# EAGLE design motor_driver_shield (EAGLE 9.6.2)
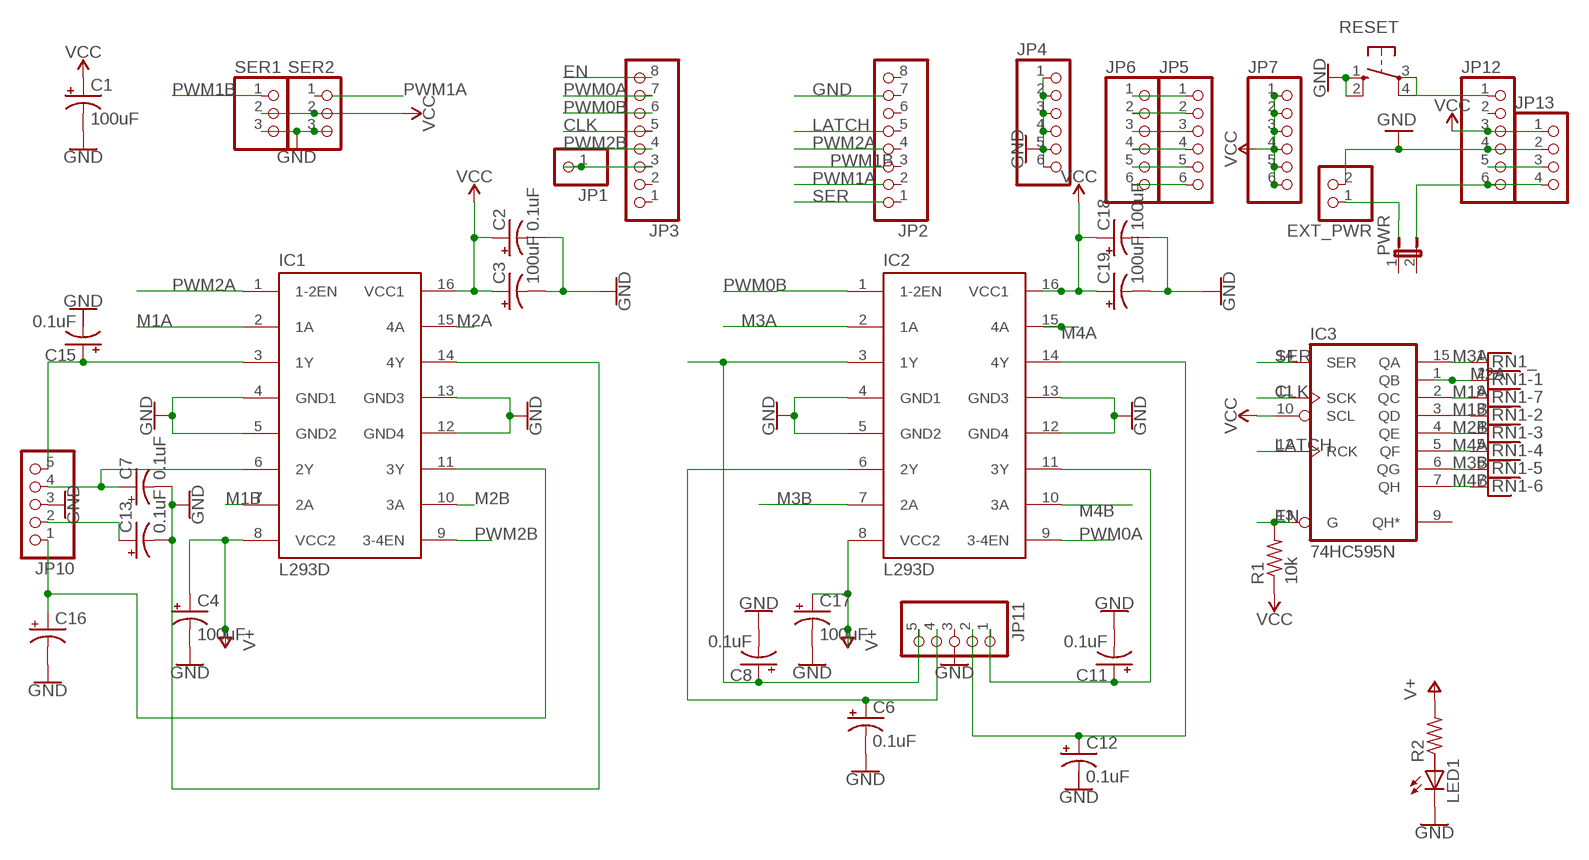
[diagram p0: schematic, sheet 1]

## Parts
C1  100uF  CPOL-USB45181A  [B45181A]
C2  0.1uF  CPOL-USB45181A  [B45181A]
C3  100uF  CPOL-USB45181A  [B45181A]
C4  100uF  CPOL-USB45181A  [B45181A]
C6  0.1uF  CPOL-USB45181A  [B45181A]
C7  0.1uF  CPOL-USB45181A  [B45181A]
C8  0.1uF  CPOL-USB45181A  [B45181A]
C11  0.1uF  CPOL-USB45181A  [B45181A]
C12  0.1uF  CPOL-USB45181A  [B45181A]
C13  0.1uF  CPOL-USB45181A  [B45181A]
C15  0.1uF  CPOL-USB45181A  [B45181A]
C16  CPOL-USB45181A  [B45181A]
C17  100uF  CPOL-USB45181A  [B45181A]
C18  100uF  CPOL-USB45181A  [B45181A]
C19  100uF  CPOL-USB45181A  [B45181A]
EXT_PWR  PINHD-1X2  [1X02]
IC1  L293D  [DIL16]
IC2  L293D  [DIL16]
IC3  74HC595N  [DIL16]
JP1  PINHD-1X1  [1X01]
JP2  PINHD-1X8-3.5MM  [1X08-3.5MM]
JP3  PINHD-1X8-3.5MM  [1X08-3.5MM]
JP4  PINHD-1X6-3.5MM  [1X06-3.5MM]
JP5  PINHD-1X6-3.5MM  [1X06-3.5MM]
JP6  PINHD-1X6-3.5MM  [1X06-3.5MM]
JP7  PINHD-1X6-3.5MM  [1X06-3.5MM]
JP10  PINHD-1X5  [1X05]
JP11  PINHD-1X5  [1X05]
JP12  PINHD-1X6-3.5MM  [1X06-3.5MM]
JP13  PINHD-1X4  [1X04]
LED1  LED5MM  [LED5MM]
PWR  JP1E  [JP1]
R1  10k  R-US_0204/2V  [0204V]
R2  R-US_0204/2V  [0204V]
RESET  40-XX  [B3F-40XX]
RN1  RNX7  [RN-8]
SER1  PINHD-1X3  [1X03]
SER2  PINHD-1X3  [1X03]

## Nets
CLK: IC3.11(SCK) JP3.5
EN: IC3.13(G) JP3.8 R1.2
GND: C1.- C2.- C3.- C4.- C6.- C7.- C8.- C11.- C13.- C16.- C17.- C18.- C19.- EXT_PWR.2 IC1.4(GND1) IC1.5(GND2) IC1.12(GND4) IC1.13(GND3) IC1.14(4Y) IC2.4(GND1) IC2.5(GND2) IC2.12(GND4) IC2.13(GND3) JP4.1 JP4.2 JP4.3 JP4.4 JP4.5 JP4.6 JP10.3 JP12.4 JP13.2 LED1.K(C) RESET.1(S) RESET.2(S1) SER1.3 SER2.3
LATCH: IC3.12(RCK)
M1A: IC1.2(1A) IC3.2(QC) RN1.8
M1B: IC1.7(2A) IC3.3(QD) RN1.3
M2A: IC1.15(4A) IC3.1(QB) RN1.2
M2B: IC1.10(3A) IC3.4(QE) RN1.4
M3A: IC2.2(1A) IC3.15(QA) RN1.1
M3B: IC2.7(2A) IC3.6(QG) RN1.6
M4A: IC2.15(4A) IC3.5(QF) RN1.5
M4B: IC2.10(3A) IC3.7(QH) RN1.7
N$1: JP5.1 JP6.1
N$2: JP5.2 JP6.2
N$3: JP5.3 JP6.3
N$4: JP5.4 JP6.4
N$5: JP5.5 JP6.5
N$6: JP1.1 JP3.3
N$7: JP5.6 JP6.6
N$9: C11.+ IC2.11(3Y) JP11.1
N$10: C6.+ IC2.6(2Y) JP11.4
N$11: C8.+ IC2.3(1Y) JP11.5
N$12: JP12.1 RESET.3(P) RESET.4(P1)
N$13: JP12.5 JP13.3
N$14: JP12.6 JP13.4
N$15: EXT_PWR.1
N$17: C15.+ IC1.3(1Y) JP10.5
N$18: C16.+ IC1.11(3Y) JP10.1
N$19: C7.+ IC1.6(2Y) JP10.4
N$20: C13.+ JP10.2
N$21: C12.+ IC2.14(4Y) JP11.2
PWM0A: IC2.9(3-4EN) JP3.7
PWM0B: IC2.1(1-2EN) JP3.6
PWM1B: SER1.1
PWM2A: IC1.1(1-2EN)
PWM2B: IC1.9(3-4EN) JP3.4
SER: IC3.14(SER)
V+: C4.+ C17.+ IC1.8(VCC2) IC2.8(VCC2) R2.2
VCC: C1.+ C2.+ C3.+ C18.+ C19.+ IC1.16(VCC1) IC2.16(VCC1) IC3.10(SCL) JP7.1 JP7.2 JP7.3 JP7.4 JP7.5 JP7.6 JP12.3 JP13.1 R1.1 SER1.2 SER2.2
Unconnected: C12.- C15.- IC3.9(QH*) JP2.1 JP2.2 JP2.3 JP2.4 JP2.5 JP2.6 JP2.7 JP2.8 JP3.1 JP3.2 JP11.3 JP12.2 LED1.A PWR.1 PWR.2 R2.1 SER2.1

## Power pins joined to a net without a drawn wire
GND: IC3.8(GND)
VCC: IC3.16(VCC)

## Library data of the parts
C1-C4 C6-C8 C11-C13 C15-C19 = adafruit:CPOL-US: POLARIZED CAPACITOR, American symbol
EXT_PWR = pinhead:PINHD-1X2: PIN HEADER
IC1 IC2 = st-microelectronics:L293D: PUSH-PULL 4 CHANNEL DRIVER; MPN: L293D; OC_FARNELL: 9589619; OC_NEWARK: 56P8249
IC3 = 74xx-eu:74*595: 8-bit SHIFT REGISTER, output latch
JP1 = adafruit:PINHD-1X1: Pin header 1x1 for 0.1" spacing With round pins
JP2 JP3 = adafruit:PINHD-1X8: PIN HEADER
JP4-JP7 JP12 = adafruit:PINHD-1X6: PIN HEADER
JP10 JP11 = pinhead:PINHD-1X5: PIN HEADER
JP13 = pinhead:PINHD-1X4: PIN HEADER
LED1 = adafruit:LED: LED OSRAM: - CHIPLED LG R971, LG N971, LY N971, LG Q971, LY Q971, LO R971, LY R971 LH N974, LH R974 LS Q976, LO Q976, LY Q976 LO Q996 - Hyper CHIPLED LW Q18S LB Q993, LB Q99A, LB R99A - SideLED LS A670, LO A670, LY A670, LG A670, LP A670 LB A673, LV A673, LT A673, LW A673 LH A674 LY A675 LS A676, LA A676, LO A676, LY A676, LW A676 LS A679, LY A679, LG A679 - Hyper Micro SIDELED® LS Y876, LA Y876, LO Y876, LY Y876 LT Y87S - SmartLED LW L88C, LW L88S LB L89C, LB L89S, LG L890 LS L89K, LO L89K, LY L89K LS L896, LA L896, LO L896, LY L896 - TOPLED LS T670, LO T670, LY T670, LG T670, LP T670 LSG T670, LSP T670, LSY T670, LOP T670, LYG T670 LG T671, LOG T671, LSG T671 LB T673, LV T673, LT T673, LW T673 LH T674 LS T676, LA T676, LO T676, LY T676, LB T676, LH T676, LSB T676, LW T676 LB T67C, LV T67C, LT T67C, LS T67K, LO T67K, LY T67K, LW E67C LS E67B, LA E67B, LO E67B, LY E67B, LB E67C, LV E67C, LT E67C LW T67C LS T679, LY T679, LG T679 LS T770, LO T770, LY T770, LG T770, LP T770 LB T773, LV T773, LT T773, LW T773 LH T774 LS E675, LA E675, LY E675, LS T675 LS T776, LA T776, LO T776, LY T776, LB T776 LHGB T686 LT T68C, LB T68C - Hyper Mini TOPLED® LB M676 - Mini TOPLED Santana® LG M470 LS M47K, LO M47K, LY M47K Source: http://www.osram.convergy.de/
PWR = jumper:JP1E: JUMPER
R1 R2 = adafruit:R-US_: RESISTOR, American symbol
RESET = adafruit:40-XX: OMRON SWITCH; MF: OMRON COMPONENTS USA; MPN: B3F-4000; OC_FARNELL: 176434; OC_NEWARK: 36K3105
RN1 = resistor-net:RNX7: RESISTOR NETWORK; OC_FARNELL: unknown; OC_NEWARK: unknown
SER1 SER2 = adafruit:PINHD-1X3: PIN HEADER

## Board
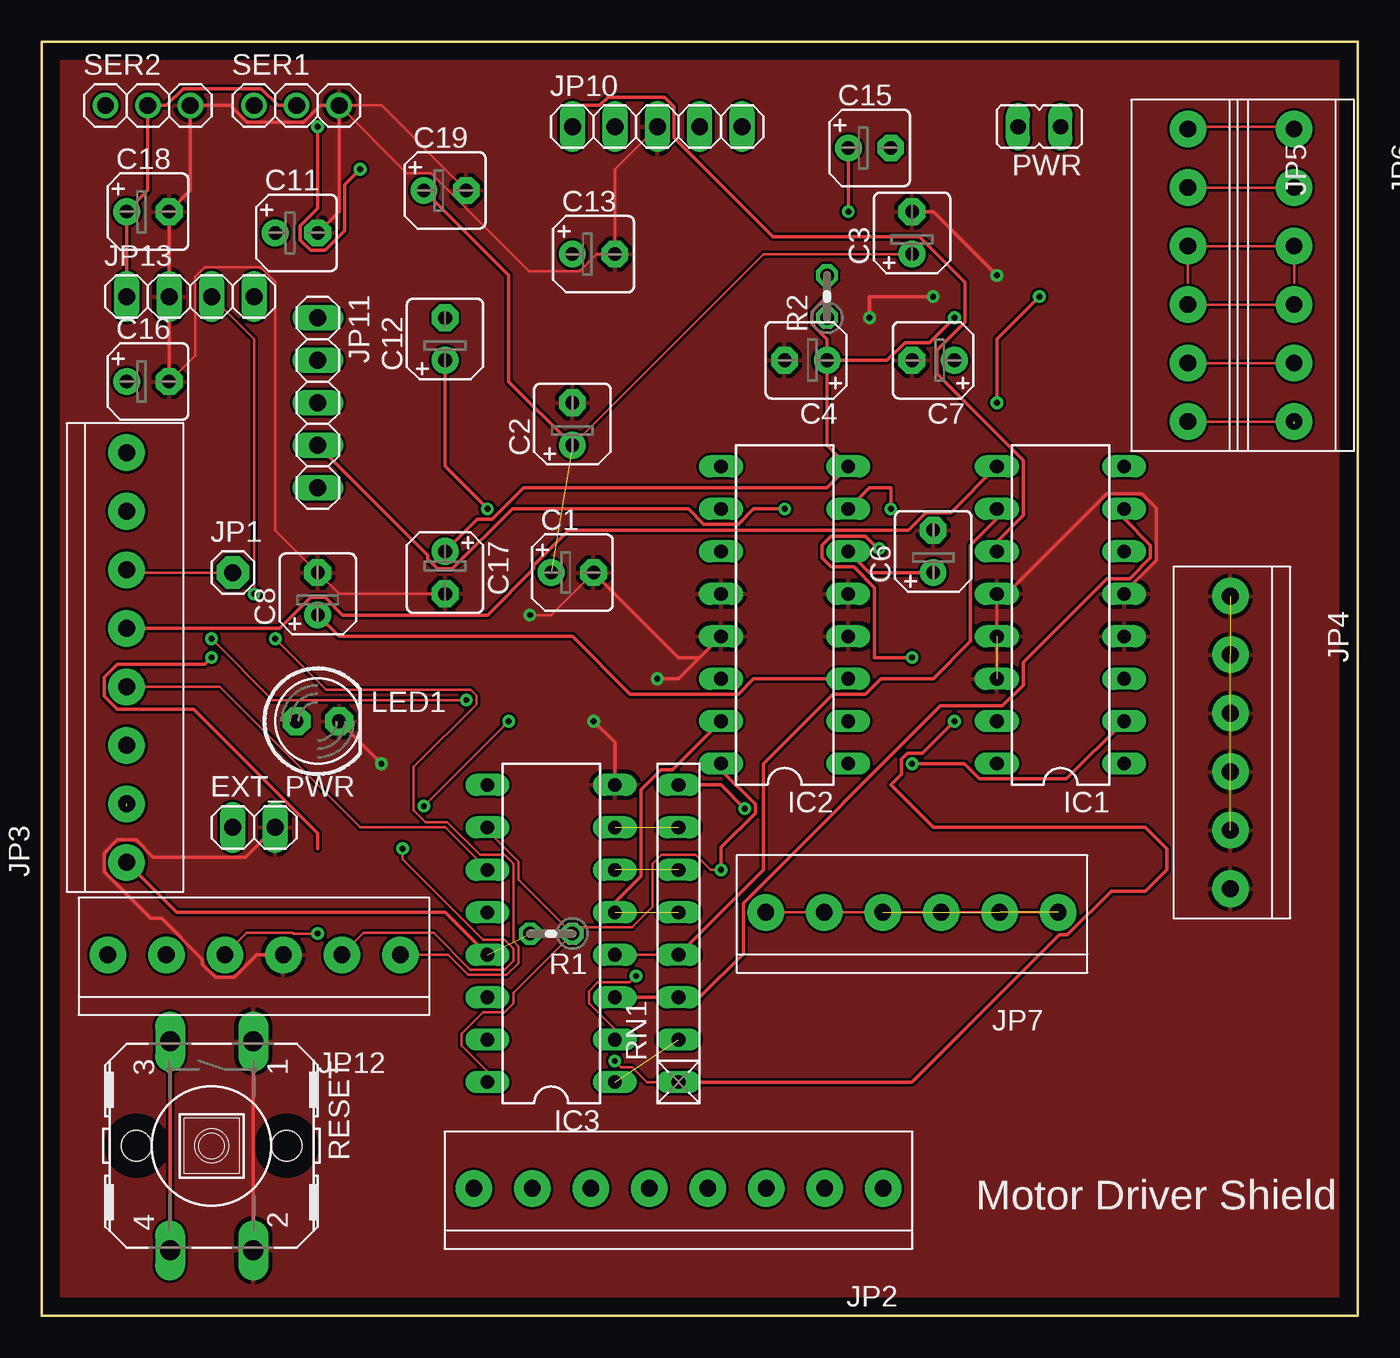
[diagram p1: board, top side]
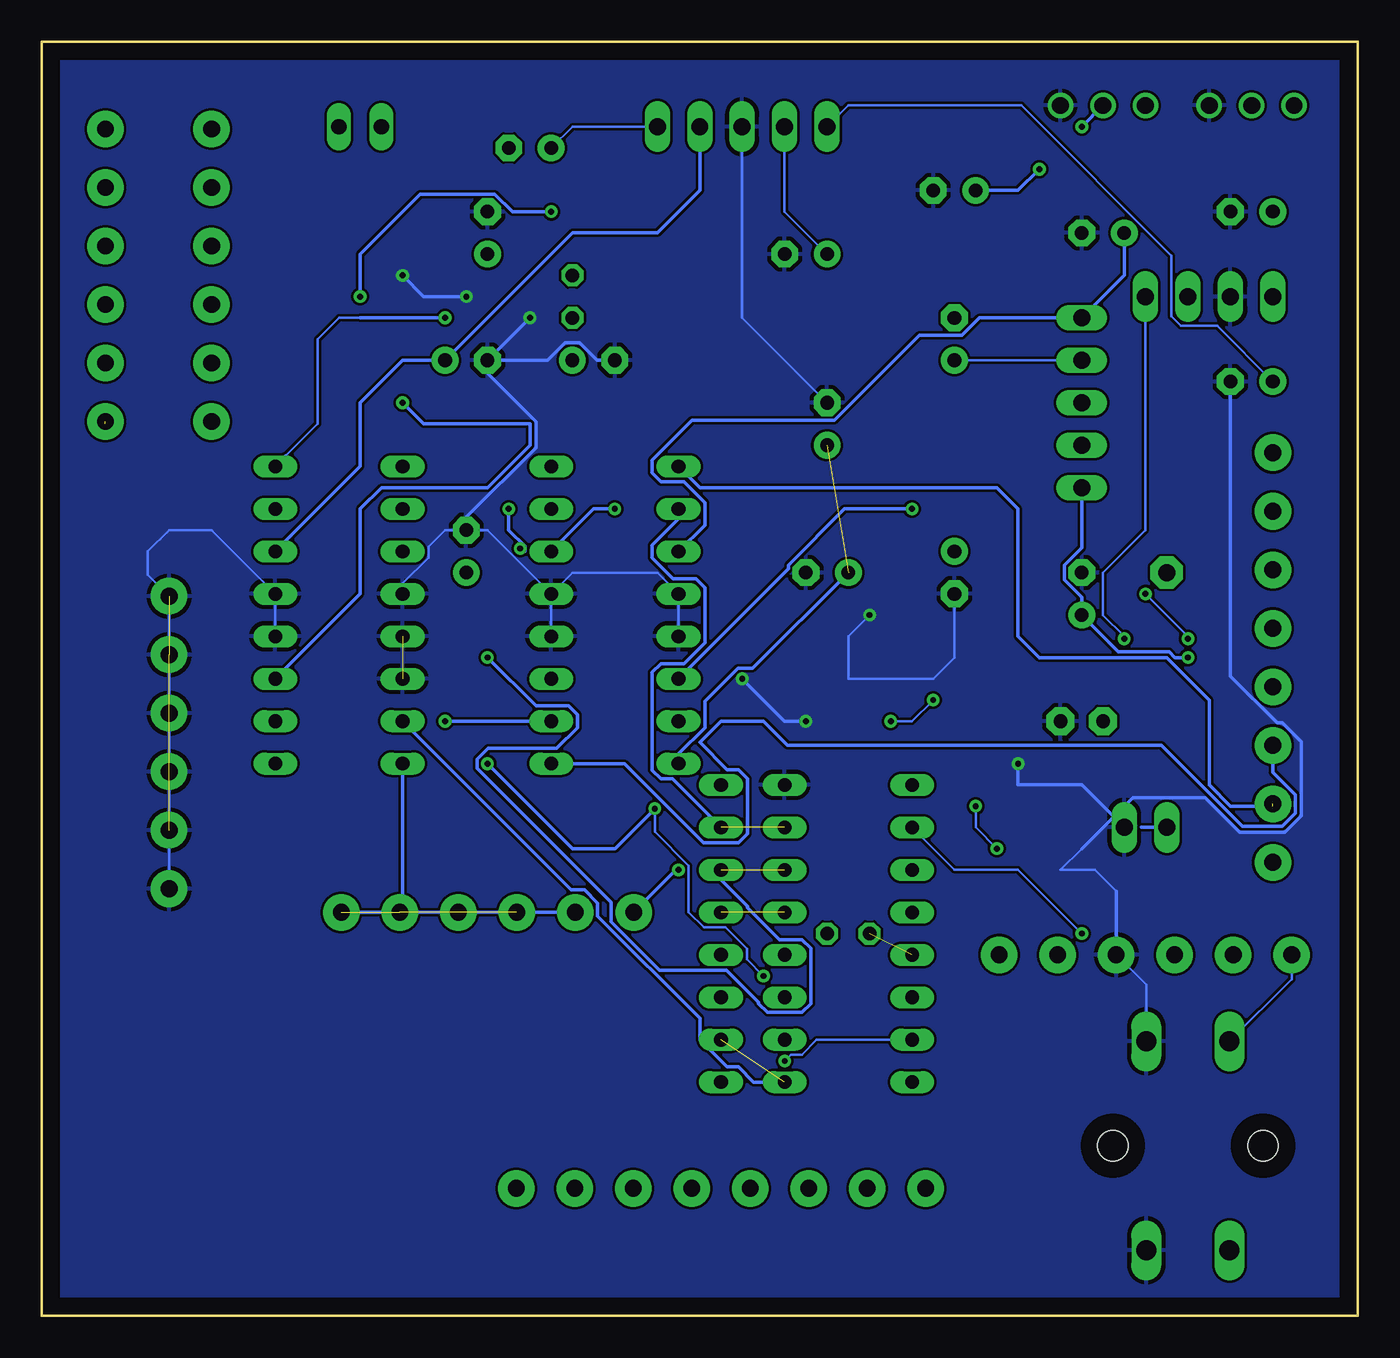
[diagram p2: board, bottom side, seen from below]

Size 78.74 x 76.2 mm. Coordinates in mm from the lower left corner, seen from the top.
Outline: 0,0 78.74,0 78.74,76.2 0,76.2 0,0
Copper layers (1*16): Top 0.035mm / dielectric 1.5mm / Bottom 0.035mm
Design rules "default": minimum track width 6mil, minimum drill 0.35mm, track to track 6mil, track to pad 6mil, pad to pad 6mil, via to via 6mil, smd to smd 6mil, copper to edge 40mil, drill to drill 6mil, minimum pad ring 10mil, minimum via ring 8mil, stop-mask expansion 4mil, vias tented up to drill 0mil, thermal gap 10mil

### Footprints (pad centres in the part's own frame; a part is rotated, then mirrored left to right if it is on the bottom)
B45181A = drill 0.813 pad 1.6: + -1.27,0 | drill 0.813 pad 1.6 octagon: - 1.27,0
1X02 = drill 1.016 long: 1 -1.27,0; 2 1.27,0
DIL16 = drill 0.813 long: 1 -8.89,-3.81; 2 -6.35,-3.81; 3 -3.81,-3.81; 4 -1.27,-3.81; 5 1.27,-3.81; 6 3.81,-3.81; 7 6.35,-3.81; 8 8.89,-3.81; 9 8.89,3.81; 10 6.35,3.81; 11 3.81,3.81; 12 1.27,3.81; 13 -1.27,3.81; 14 -3.81,3.81; 15 -6.35,3.81; 16 -8.89,3.81
1X01 = drill 1.016 pad 1.93 octagon: 1 0,0
1X08-3.5MM = drill 1 pad 2.184: 1 -12.25,0; 2 -8.75,0; 3 -5.25,0; 4 -1.75,0; 5 1.75,0; 6 5.25,0; 7 8.75,0; 8 12.25,0
1X06-3.5MM = drill 1 pad 2.184: 1 -8.75,0; 2 -5.25,0; 3 -1.75,0; 4 1.75,0; 5 5.25,0; 6 8.75,0
1X05 = drill 1.016 long: 1 -5.08,0; 2 -2.54,0; 3 0,0; 4 2.54,0; 5 5.08,0
1X04 = drill 1.016 long: 1 -3.81,0; 2 -1.27,0; 3 1.27,0; 4 3.81,0
LED5MM = drill 0.813 pad 1.676 octagon: A -1.27,0; K 1.27,0
JP1 = drill 0.914 long: 1 0,-1.27; 2 0,1.27
0204V = drill 0.813 octagon: 1 -1.27,0; 2 1.27,0
B3F-40XX = drill 1.194 long: 1 -6.248,2.489; 2 6.248,2.489; 3 -6.248,-2.489; 4 6.248,-2.489 | hole 1.803: 0,-4.496; 0,4.496
RN-8 = drill 0.813 long: 1 -8.89,0; 2 -6.35,0; 3 -3.81,0; 4 -1.27,0; 5 1.27,0; 6 3.81,0; 7 6.35,0; 8 8.89,0
1X03 = drill 1.016: 1 -2.54,0; 2 0,0; 3 2.54,0

### Placement (x,y rotation side)
C1  31.75,44.45 0 top
C2  31.75,53.34 90 top
C3  52.07,64.77 90 top
C4  45.72,57.15 180 top
C6  53.34,45.72 90 top
C7  53.34,57.15 180 top
C8  16.51,43.18 90 top
C11  15.24,64.77 0 top
C12  24.13,58.42 90 top
C13  33.02,63.5 0 top
C15  49.53,69.85 0 top
C16  6.35,55.88 0 top
C17  24.13,44.45 270 top
C18  6.35,66.04 0 top
C19  24.13,67.31 0 top
EXT_PWR  12.7,29.21 0 top
IC1  60.96,41.91 90 top
IC2  44.45,41.91 90 top
IC3  30.48,22.86 90 top
JP1  11.43,44.45 0 top
JP2  38.1,7.62 0 top
JP3  5.08,39.37 270 top
JP4  71.12,34.29 90 top
JP5  68.58,62.23 90 top
JP6  74.93,62.23 90 top
JP7  52.07,24.13 0 top
JP10  36.83,71.12 0 top
JP11  16.51,54.61 270 top
JP12  12.7,21.59 0 top
JP13  8.89,60.96 0 top
LED1  16.51,35.56 0 top
PWR  59.69,71.12 90 top
R1  30.48,22.86 180 top
R2  46.99,60.96 90 top
RESET  10.16,10.16 270 top
RN1  38.1,22.86 90 top
SER1  15.24,72.39 0 top
SER2  6.35,72.39 0 top

### Tracks (layer width: path | path; a pad name or v marks a point on that pad's centre or on a via)
CLK
  Top 0.152: JP3.5 10.64,37.62 19.05,29.21 24.13,29.21 IC3.11
EN  (1 unrouted)
  Top 0.198: JP3.8 8.07,24.13 24.13,24.13 IC3.13
GND  (via drill 0.35)  (5 unrouted)
  Top 0.152: JP10.3 34.29,68.58 C13.- 33.2,63.5 32.18,62.47 29.15,62.47 23.29,68.34 21.83,68.34 SER1.3 20.32,72.39 C19.- | IC1.12 IC1.14 | C1.- 30.48,41.91 v29.21,41.91 | C17.- 17.78,43.18 C8.- 13.97,46.99 13.97,61.85 13.11,62.71 9.75,62.71 9.17,62.13 9.17,57.43 C16.-
  Top 0.198: C16.- JP13.2 C18.- 8.89,67.31 SER2.3 11.27,72.39 12.28,71.38 15.66,71.38 16.67,72.39 SER1.3 17.78,66.04 C11.- | C1.- 38.1,39.37 39.37,39.37 IC2.13 38.1,38.1 v36.83,38.1 | v33.02,35.56 34.29,34.29 IC3.8 | IC1.5 64.77,43.27 66.69,45.2 66.69,48.29 65.81,49.17 63.73,49.17 57.74,43.18 IC1.12 | C3.- 53.34,66.04 v57.15,62.23 | v53.34,60.96 49.53,60.96 v49.53,59.69 | v20.32,33.02 LED1.K | JP12.4 12.85,21.59 11.51,20.25 10.39,20.25 9.61,21.03 9.61,21.33 7.16,23.78 6.52,23.78 3.74,26.56 3.74,27.68 4.52,28.46 5.64,28.46 6.67,27.43 12.2,27.43 EXT_PWR.2 | RESET.2 12.65,9.31 12.64,9.32 12.64,10.99 12.65,11.01 RESET.1
  Bottom 0.152: JP4.1 JP4.6 | 71.12,43.18 JP4.6 | C2.- 36.83,59.69 JP10.3 | RESET.1 12.65,19.79 JP12.4 | IC2.13 IC2.12 41.91,44.45 46.99,44.45 IC2.5 | IC2.4 IC2.5 | IC2.5 52.07,46.99 C6.- 54.61,46.99 55.6,46 55.6,45.35 57.15,43.8 IC1.12 | IC1.4 IC1.5 68.58,46.99 71.12,46.99 72.39,45.72 72.39,44.31 JP4.6 | C17.- 24.13,39.37 25.4,38.1 30.48,38.1 30.48,40.64 v29.21,41.91 | 14.45,25.4 15.72,26.67 17.78,26.67 16.51,27.94
  Bottom 0.198: JP12.4 14.45,25.4 | v36.83,38.1 34.29,35.56 v33.02,35.56 | C4.- 45.5,57.15 46.55,58.2 47.43,58.2 48.48,57.15 C7.- | v57.15,62.23 55.88,60.96 v53.34,60.96 | v49.53,59.69 C7.- | C6.- 53.34,47.76 49.18,51.93 49.18,53.49 52.07,56.38 C7.- | C16.- 7.62,38.26 4.82,35.46 4.52,35.46 3.39,34.33 3.39,29.92 4.38,28.93 7.06,28.93 9.12,30.98 13.46,30.98 16.51,27.94 | EXT_PWR.2 16.51,31.75 20.32,31.75 v20.32,33.02
  pour Top: 0,76.2 78.74,76.2 78.74,0 0,0
  pour Bottom: 0,76.2 78.74,76.2 78.74,0 0,0
M1A  (via drill 0.35)
  Top 0.152: v35.56,20.32 35.18,19.94 33.26,19.94 32.74,19.42 32.74,18.68 34.29,17.13 IC3.2
  Top 0.198: v52.07,33.02 55.2,33.02 56.11,32.11 61.32,32.11 IC1.2 | v42.06,30.33 40.64,31.75 RN1.8
  Bottom 0.152: v35.56,20.32 36.55,21.31 36.55,21.96 37.83,23.24 39.13,23.24 40.03,24.15 40.03,26.92 42.06,28.95 v42.06,30.33
  Bottom 0.198: v52.07,33.02 46.99,27.94 44.45,27.94 v42.06,30.33 41.91,30.48
M1B
  Top 0.198: IC1.7 64.77,47.67 66.34,46.1 66.34,45.34 65.09,44.09 63.73,44.09 58.72,39.08 58.72,37.72 57.47,36.47 53.76,36.47 41.98,24.69 41.98,21.66 39.37,19.05 RN1.3 IC3.3
M2A  (1 unrouted)
  Bottom 0.198: IC1.15 47.06,25.47 46.26,25.47 45.48,24.69 45.48,23.89 39.37,17.78 39.37,16.51 37.74,14.88 37.06,14.88 36.15,13.97 IC3.1
M2B
  Top 0.152: IC3.4 RN1.4
  Top 0.198: RN1.4 43.18,26.67 43.18,33.02 47.35,37.19 49.3,37.19 50.21,38.1 53.34,38.1 55.58,40.34 55.58,46.1 57.15,47.67 IC1.10
M3A  (via drill 0.35)
  Top 0.152: v34.29,15.24 34.67,14.86 35.32,14.86 36.21,13.97 RN1.1
  Top 0.198: v54.61,35.56 52.7,33.65 51.81,33.65 51.44,33.28 51.44,32.39 50.8,31.75 53.34,29.21 66.04,29.21 67.31,27.94 67.31,26.67 66.04,25.4 63.99,25.4 61.38,22.79 60.89,22.79 52.07,13.97 RN1.1
  Bottom 0.152: v34.29,15.24 33.91,15.62 33.26,15.62 32.37,16.51 IC3.15
  Bottom 0.198: v54.61,35.56 IC2.2 47.04,35.56
M3B  (via drill 0.35)  (1 unrouted)
  Top 0.198: IC2.7 49.53,49.53 50.8,49.53 v50.8,48.26 | v50.11,45.89 49.94,45.72 49.83,45.72 49.83,46.1 49.3,46.63 47.22,46.63 46.69,46.1 46.69,45.34 47.22,44.81 48.58,44.81 49.83,43.56 49.83,39.37 v52.07,39.37
  Bottom 0.198: v50.8,48.26 50.8,46.99 49.83,46.02 49.83,45.72 49.94,45.72 v50.11,45.89 | v52.07,39.37 49.17,36.47 47.22,36.47 46.69,35.94 46.69,35.18 47.94,33.93 52.05,33.93 52.7,33.28 52.7,32.76 44.66,24.72 44.66,23.57 41.77,20.68 37.78,20.68 35.86,18.76 35.86,18.67 35.33,18.14 33.25,18.14 32.72,18.67 32.72,21.97 33.25,22.5 34.61,22.5 36.53,24.42 36.53,24.51 38.1,26.08 RN1.6
M4A  (1 unrouted)
  Top 0.198: IC2.15 37.74,32.66 37.06,32.66 35.86,31.46 35.86,26.29 34.29,24.72 IC3.5
M4B  (1 unrouted)
  Bottom 0.198: IC2.10 40.64,47.67 42.21,46.1 42.21,45.34 40.96,44.09 39.6,44.09 39.07,43.56 39.07,40.26 40.32,39.01 41.68,39.01 42.21,38.48 42.21,32.64 41.68,32.11 41,32.11 RN1.7
N$1  (1 unrouted)
  Top 0.152: JP5.1 74.79,53.48 74.93,53.34
N$2
  Top 0.152: JP5.2 JP6.2
N$3
  Top 0.152: JP5.3 JP6.3
N$4
  Top 0.152: 68.58,61.8 JP5.4 74.45,63.98 74.93,63.5 JP6.4 74.93,61.8
N$5
  Top 0.152: JP5.5 JP6.5
N$6
  Top 0.152: JP3.3 5.25,44.45 JP1.1
N$7
  Top 0.152: JP5.6 68.72,71.12 74.93,71.12 JP6.6
N$9
  Bottom 0.198: IC2.11 39.07,47.29 39.07,48.64 40.32,49.89 41.68,49.89 42.21,50.42 42.21,51.18 39.83,53.56 31.31,53.56 26.23,58.64 23.69,58.64 22.64,59.69 JP11.1 13.97,62.23 C11.+
N$10  (via drill 0.35)
  Top 0.198: v44.45,48.26 42.59,48.26 41.68,47.35 39.6,47.35 38.69,48.26 28.16,48.26 24.57,44.67 23.69,44.67 23.08,45.28 23.08,45.5 JP11.4 | C6.+ 49.53,44.45 IC2.6
  Bottom 0.198: IC2.6 45.72,48.26 v44.45,48.26
N$11  (via drill 0.35)
  Top 0.198: IC2.3 42.59,38.1 41.68,37.19 35.2,37.19 31.75,40.64 17.78,40.64 C8.+ | 16.51,27.94 16.51,28.86 9.1,36.28 4.52,36.28 3.74,37.06 3.74,38.18 4.52,38.96 9.75,38.96 v10.16,39.37
  Bottom 0.198: JP11.5 16.51,45.94 17.56,44.89 17.56,44.01 16.51,42.96 C8.+ 14.32,39.72 11.29,39.72 10.93,39.37 v10.16,39.37
N$12
  Top 0.198: RESET.4 7.67,9.31 7.68,9.32 7.68,15.18 7.62,15.24 7.62,16.36 RESET.3
  Bottom 0.152: RESET.3 3.95,20.13 JP12.1
N$13  (via drill 0.35)
  Top 0.152: JP13.3 12.7,58.42 v12.7,43.18 | v10.16,40.49 13.82,36.83 v25.4,36.83 | v27.94,35.56 v22.86,30.48 | v21.59,27.94 21.59,27.29 26.4,22.48 27.7,22.48 28.22,21.96 28.22,21.22 27.7,20.7 25.64,20.7 23.43,22.91 19.27,22.91 JP12.5
  Bottom 0.152: v12.7,43.18 10.16,40.64 v10.16,40.49 | v25.4,36.83 26.67,35.56 v27.94,35.56 | v22.86,30.48 22.86,29.21 v21.59,27.94
N$14  (via drill 0.35)
  Top 0.152: v13.97,40.49 17.02,37.44 25.65,37.44 26.01,37.08 26.01,36.58 22.25,32.83 22.25,30.23 22.97,29.52 24.26,29.52 26.21,27.56 27.7,27.56 28.22,27.04 28.22,22.39 28.52,22.08 28.52,21.1 27.82,20.4 25.52,20.4 24.32,21.59 JP12.6
  Bottom 0.152: JP13.4 12.7,46.99 15.24,44.45 15.24,41.91 13.97,40.64 v13.97,40.49
N$15
  Bottom 0.198: EXT_PWR.1 12.96,29.21
N$17  (via drill 0.35)
  Top 0.198: C15.+ v48.26,66.04 | v59.69,60.96 57.15,58.42 v57.15,54.61
  Bottom 0.152: JP10.5 46.99,71.12 C15.+
  Bottom 0.198: IC1.3 59.69,43.18 59.69,48.26 58.42,49.53 52.07,49.53 49.53,52.07 49.53,53.34 55.88,53.34 v57.15,54.61 | v48.26,66.04 50.58,66.04 51.63,67.09 56.1,67.09 59.69,63.5 v59.69,60.96
N$18
  Top 0.198: IC1.11 57.15,46.31 58.72,47.88 58.72,51.18 53.56,56.34 53.56,57.75 55.24,59.43 55.24,61.82 52.51,64.55 43.74,64.55 37.84,70.45 37.84,72.3 37.25,72.89 33.87,72.89 33.36,72.39 31.75,72.39 JP10.1
  Bottom 0.152: C16.+ 8.41,59.21 10.57,59.21 11.15,59.79 11.15,63.41 20.14,72.39 30.48,72.39 JP10.1
N$19
  Bottom 0.198: IC1.6 59.69,50.8 59.69,54.61 57.15,57.15 C7.+ 46.99,64.77 41.91,64.77 39.37,67.31 JP10.4
N$20
  Bottom 0.152: JP10.2 34.29,66.04 C13.+
N$21  (via drill 0.35)
  Top 0.198: v26.67,48.26 24.13,50.8 C12.+
  Bottom 0.152: C12.+ JP11.2
  Bottom 0.198: IC2.14 34.07,44.67 34.07,44.89 30.7,48.26 v26.67,48.26
PWM0A  (1 unrouted)
  Bottom 0.198: IC2.9 39.37,49.53 21.59,49.53 20.32,48.26 20.32,40.64 19.05,39.37 11.43,39.37 8.89,36.83 8.89,31.75 7.62,30.48 5.08,30.48
PWM0B
  Bottom 0.198: JP3.6 5.08,32.52 3.74,31.18 3.74,30.06 4.52,29.28 6.91,29.28 11.76,34.12 34.12,34.12 35.56,35.56 38.1,35.56 39.37,34.29 37.74,32.66 37.06,32.66 36.53,32.13 36.53,28.83 37.06,28.3 39.14,28.3 43.86,33.02 IC2.1
PWM2B
  Top 0.198: IC1.9 54.39,48.04 52.9,48.04 51.85,46.99 31.53,46.99 29.43,44.89 29.43,44.67 26.67,41.91 18,41.91 16.95,42.96 16.07,42.96 14.23,41.12 JP3.4
V+  (via drill 0.35)
  Top 0.198: v54.61,59.69 53.12,58.2 51.63,58.2 50.58,57.15 C4.+ | C4.+ 46.99,52.07 IC2.8 46.99,49.53 28.83,49.53 26.93,47.63 26.04,47.63 C17.+ | C4.+ 46.99,58.4 46.08,59.31 46.08,60.07 46.99,60.98 R2.2
  Bottom 0.152: 59.69,59.69 60.96,59.69 62.23,58.42 62.23,53.34 64.14,51.44
  Bottom 0.198: IC1.8 64.14,51.44 | v54.61,59.69 59.69,59.69
VCC  (via drill 0.35)  (4 unrouted)
  Top 0.152: JP7.1 JP7.6 | v16.51,22.86 15.05,22.86 15,22.91 12.27,22.91 JP12.3 | C2.+ 43.18,63.5 C3.+ | R1.1 28.22,19.33 28.22,18.68 27.7,18.16 26.4,18.16 25.12,16.88 25.12,16.14 26.67,14.59 IC3.16 | R1.1 28.52,26.09 28.52,27.16 26.67,29.02 IC3.10 | R1.1 32.13,23.24 35.32,23.24 36.55,24.47 36.55,27.04 37.07,27.56 39.13,27.56 40.02,26.67 v40.64,26.67
  Top 0.198: SER1.2 14.13,72.39 13.12,73.4 8.47,73.4 7.46,72.39 SER2.2 6.35,67.31 C18.+ JP13.1 | C2.+ 27.94,55.88 27.94,62.23 C19.+ | IC2.16 40.64,32.64 42.69,30.59 42.69,30.07 40.64,28.02 v40.64,26.67 | v19.05,68.58 18.13,67.66 18.13,64.9 16.95,63.72 16.07,63.72 15.46,64.33 15.46,65.21 16.51,66.26 v16.51,71.12
  Bottom 0.152: v16.51,22.86 20.32,26.67 24.13,26.67 IC3.10
  Bottom 0.198: IC1.16 57.15,24.3 JP7.5 | v40.64,26.67 40.78,26.67 JP7.1 | C19.+ 20.32,67.31 v19.05,68.58 | v16.51,71.12 SER1.2 | C1.+ 36.2,38.73 37.09,38.73 39.07,36.75 39.07,35.18 40.64,33.61 IC2.16 | JP7.2 JP7.6

### Text on the board
tNames: Motor Driver Shield